# EasyEDA schematic SCH_BandBuddy.json
TITLE: Band Buddy PCB Design; REV: 1.0; Date: 2022-05-26; Sheet: 1/1; Drawn By: mmony
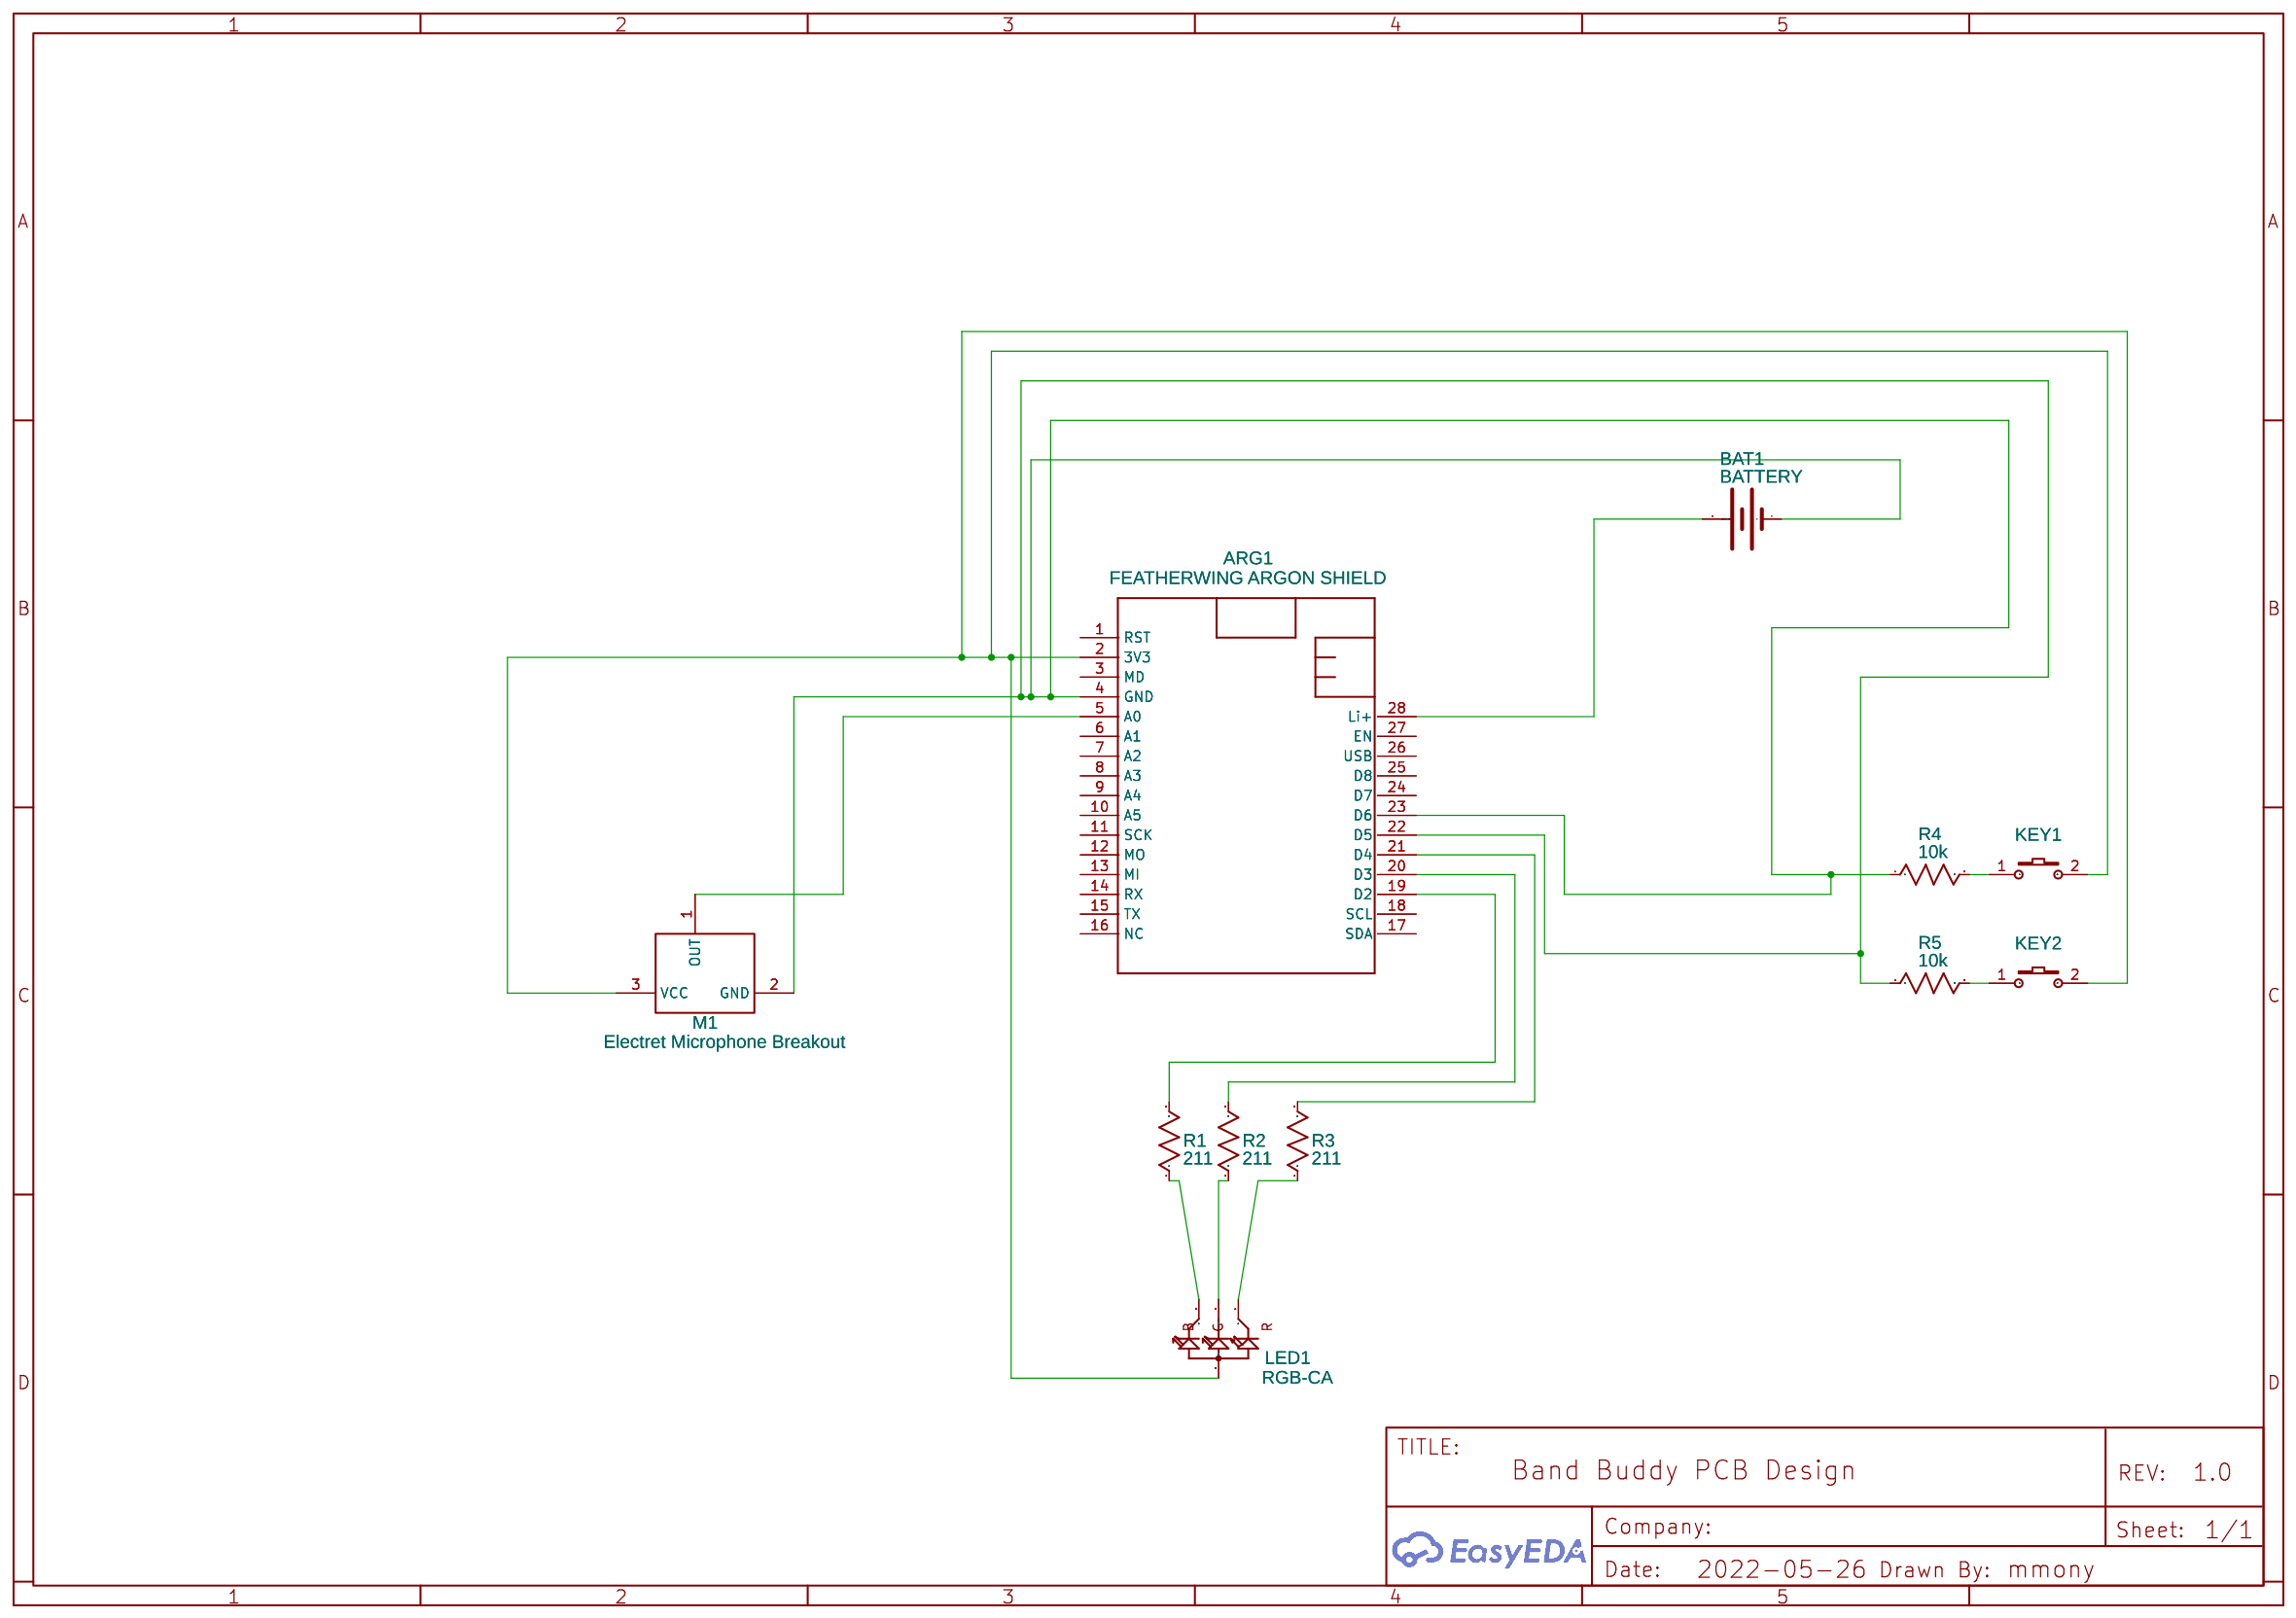
[diagram p0: schematic sheet]

## Parts
ARG1  FEATHERWING ARGON SHIELD  [FEATHERWING_NODIM]
BAT1  BATTERY  [LIPO-1100MAH]
KEY1  K2-3.6×6.1_SMD  [KEY-SMD_2P-L6.2-W3.6-LS8.0]
KEY2  K2-3.6×6.1_SMD  [KEY-SMD_2P-L6.2-W3.6-LS8.0]
LED1  RGB-CA  [LED4-1.3-D5.0MM]
M1  Electret Microphone Breakout  [SOUND SENSOR (HORIZONTAL)]
R1  211  [R0603]
R2  211  [R0603]
R3  211  [R0603]
R4  10k  [R0603]
R5  10k  [R0603]

## Library data of the parts
ARG1 = FEATHERWING_NODIM: Contributor: horacezhang
BAT1 = BATTERY: Contributor: SparkFun
KEY1 KEY2 = K2-3.6×6.1_SMD: Supplier Part: C118141; Supplier: LCSC; Manufacturer Part: K2-1107ST-A4SW-06; Contributor: LCEDA_Lib; 制造商: 韩国韩荣
LED1 = FZR50RGB00T-C: DIP LED RGB Common Anode;
M1 = Sound Sensor (Horizontal): Contributor: DEFMod
R1-R5 = R_0603_US: Contributor: LCEDA_Lib

## Nets
Net-(ARG1-2): ARG1.2(3V3) KEY1.2 KEY2.2 LED1.C(+) M1.3(VCC)
Net-(ARG1-4): ARG1.4(GND) ARG1.22(D5) ARG1.23(D6) BAT1.- M1.2(GND) R4.1 R5.1
Net-(ARG1-5): ARG1.5(A0) M1.1(OUT)
Net-(ARG1-19): ARG1.19(D2) R1.2
Net-(ARG1-20): ARG1.20(D3) R2.2
Net-(ARG1-21): ARG1.21(D4) R3.2
Net-(ARG1-28): ARG1.28(Li+) BAT1.+
Net-(KEY1-1): KEY1.1 R4.2
Net-(KEY2-1): KEY2.1 R5.2
Net-(LED1-B): LED1.B R3.1
Net-(LED1-G): LED1.G R1.1
Net-(LED1-R): LED1.R R2.1

Not connected (* = marked no-connect by the designer): ARG1 1(RST) 3(MD) 6(A1) 7(A2) 8(A3) 9(A4) 10(A5) 11(SCK) 12(MO) 13(MI) 14(RX) 15(TX) 16(NC) 17(SDA) 18(SCL) 24(D7) 25(D8) 26(USB) 27(EN)
